# Altium project Nrf2Serial_Prj.PrjPcb
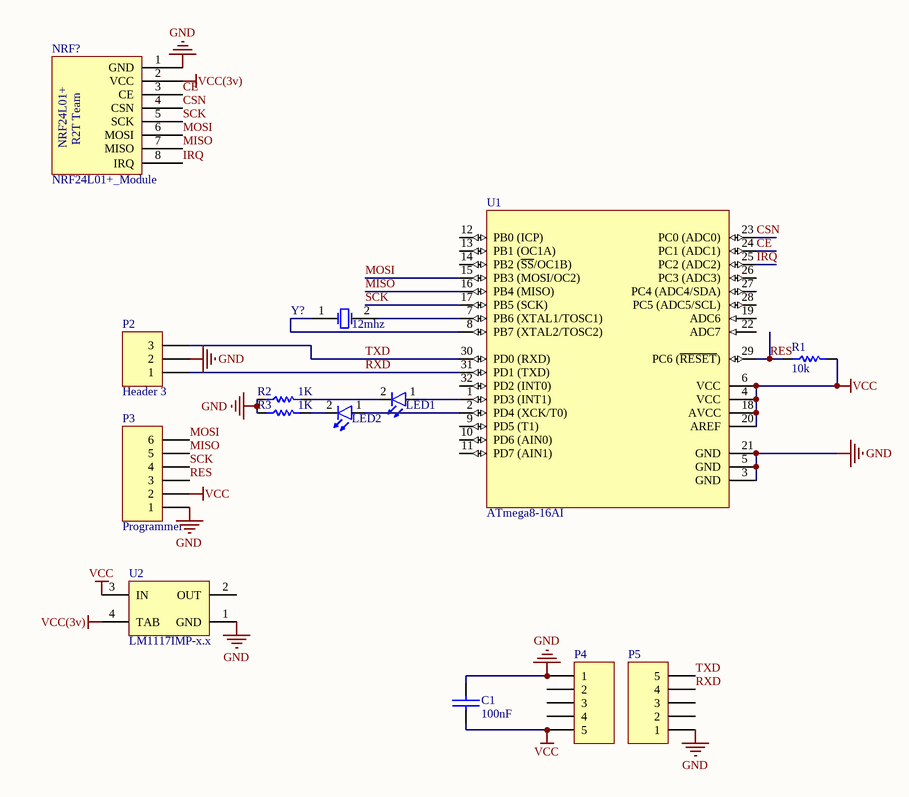
[diagram p0: Nrf2Serial_SCH.SchDoc]
1 sheet, 14 parts. Net scope: global (net labels, ports and power ports of the same name join across sheets).
Board file: Nrf2Serial.PcbDoc

## Sheet Nrf2Serial_SCH.SchDoc
size A

### Parts
C1  100nF  [SMD_CAP_1206]
LED1  (no value)  [LED SMD 1206]
LED2  (no value)  [LED SMD 1206]
NRF?  NRF24L01+_Module  [NRF24L01+_Module]
P2  Header 3  [HDR1X3]
P3  Programmer  [HDR1X6]
P4  Header 5  [My_1X05]  (value not drawn)
P5  Header 5  [My_1X05]  (value not drawn)
R1  10k  [RES 0805 (2012X06L)]
R2  1K  [RES 0805 (2012X06L)]
R3  1K  [RES 0805 (2012X06L)]
U1  ATmega8-16AI  [My_32A_M]
U2  LM1117IMP-x.x  [MP04A_N]
Y?  12mhz  [XTAL Small]

### Nets
GND: C1.1(+) NRF?.1(GND) P2.2 P3.1 P4.1 P5.1 R2.1 R3.1 U1.3(GND) U1.5(GND) U1.21(GND) U2.1(GND)
VCC: C1.2(-) P3.2 P4.5 R1.2 U1.4(VCC) U1.6(VCC) U1.18(AVCC) U1.20(AREF) U2.3(IN)
VCC(3v): NRF?.2(VCC) U2.4(TAB)
CE: NRF?.3(CE) U1.24(PC1_(ADC1))
CSN: NRF?.4(CSN) U1.23(PC0_(ADC0))
IRQ: NRF?.8(IRQ) U1.25(PC2_(ADC2))
MISO: NRF?.7(MISO) P3.5 U1.16(PB4_(MISO))
MOSI: NRF?.6(MOSI) P3.6 U1.15(PB3_(MOSI/OC2))
RES: P3.3 R1.1 U1.29(PC6_(~{RESET}))
RXD: P2.1 P5.4 U1.31(PD1_(TXD))
SCK: NRF?.5(SCK) P3.4 U1.17(PB5_(SCK))
TXD: P2.3 P5.5 U1.30(PD0_(RXD))
NetLED1_1: LED1.1(A) U1.1(PD3_(INT1))
NetLED1_2: LED1.2(K) R2.2
NetLED2_1: LED2.1(A) U1.2(PD4_(XCK/T0))
NetLED2_2: LED2.2(K) R3.2
NetU1_7: U1.7(PB6_(XTAL1/TOSC1)) Y?.2(OSC2)
NetU1_8: U1.8(PB7_(XTAL2/TOSC2)) Y?.1(OSC1)

Not connected (* = marked no-connect by the designer): P4 2 3 4; P5 2 3; U1 9(PD5_(T1)) 10(PD6_(AIN0)) 11(PD7_(AIN1)) 12(PB0_(ICP)) 13(PB1_(OC1A)) 14(PB2_(~{SS}/OC1B)) 19(ADC6) 22(ADC7) 26(PC3_(ADC3)) 27(PC4_(ADC4/SDA)) 28(PC5_(ADC5/SCL)) 32(PD2_(INT0)); U2 2(OUT)

### Notes on the sheet
- (in symbol NRF24L01+_Module) R2T Team; NRF24L01+

### Library data of the parts
C1 = Cap-Bipolar: Bipolar Capacitor; Voltage: 100V; Designer: Saeid Jorablo; Organazation: ControTec; Adding Date: 1387/12/20; Value: 100nF
LED1 LED2 = LED: Designer: Saeid Jorablo; Organazation: ControTec; Adding Date: 1387/12/22
NRF? = NRF24L01+_Module: Designer:: HamedJafarzadeh
P2 = Header 3: Header, 3-Pin; LatestRevisionDate: 17-Jul-2002; LatestRevisionNote: Re-released for DXP Platform.; Publisher: Altium Limited
P3 = Header 6: Header, 6-Pin; LatestRevisionDate: 17-Jul-2002; LatestRevisionNote: Re-released for DXP Platform.; Publisher: Altium Limited
P4 P5 = Header 5: Header, 5-Pin; LatestRevisionDate: 17-Jul-2002; LatestRevisionNote: Re-released for DXP Platform.; Publisher: Altium Limited
R1-R3 = Resistor
  R1: Value: 10k
  R2 R3: Value: 1K
U1 = ATmega8-16AI: AVR 8K Bytes of In-System Programmable Flash Memory; Published: 17-Sep-2003; LatestRevisionDate: 13-Apr-2006; LatestRevisionNote: IPC-7351 Footprint Added.; DatasheetVersion: 2486H-AVR-09/02; PackageVersion: revB, Oct-2001; PackageReference: 32A; Publisher: Altium Limited; PackageDescription: 32-Pin Thin Quad Flat Pack 0.8 mm Pitch; Code_JEDEC: MS-026-ABA; ComponentLink1Description: Manufacturer Link; ComponentLink1URL: http://www.atmel.com; ComponentLink2Description: Datasheet; ComponentLink2URL: http://www.atmel.com/dyn/resources/prod_documents/doc2486.pdf
U2 = LM1117IMP-x.x: x.x Volt, 800mA Low-Dropout Linear Regulator, 4-pin SOT-223; PartNumber: LM1117IMP-3.3; Manufacturer: National Semiconductor; PackageTopMarking: XYTT*N05B; PowerWise: N; CompType: LDO IC; Published: 4-Dec-2008; DatasheetVersion: Apr-2006; PackageVersion: revB, Apr-2003; PackageReference: MP04A; Publisher: Altium Limited; PackageDescription: Molded SOT-223, 6.50 x 3.56 x 1.6mm Body, 4 Lead, 2.3mm Pitch; Supplier 1: Farnell; Supplier Part Number 1: 7614123; RoHS: N; PinCount: 4; Code_JEDEC: TO-261-AA; Code_IPC: SOT223-4; ComponentLink1Description: LM1117 Datasheet; ComponentLink1URL: http://www.national.com/ds/LM/LM1117.pdf; ComponentLink2Description: LM1117 Web Page; ComponentLink2URL: http://www.national.com/pf/LM/LM1117.html; ComponentLink3Description: MP04A Package Page; ComponentLink3URL: http://www.national.com/packaging/folders/mp04a.html
Y? = XTAL: XTAL Crystal; Company: E.P.I.L; Design Date: 11/04/2011; Value: 12mhz